# EAGLE design TIPIC_Schematic1 (EAGLE 6.2)
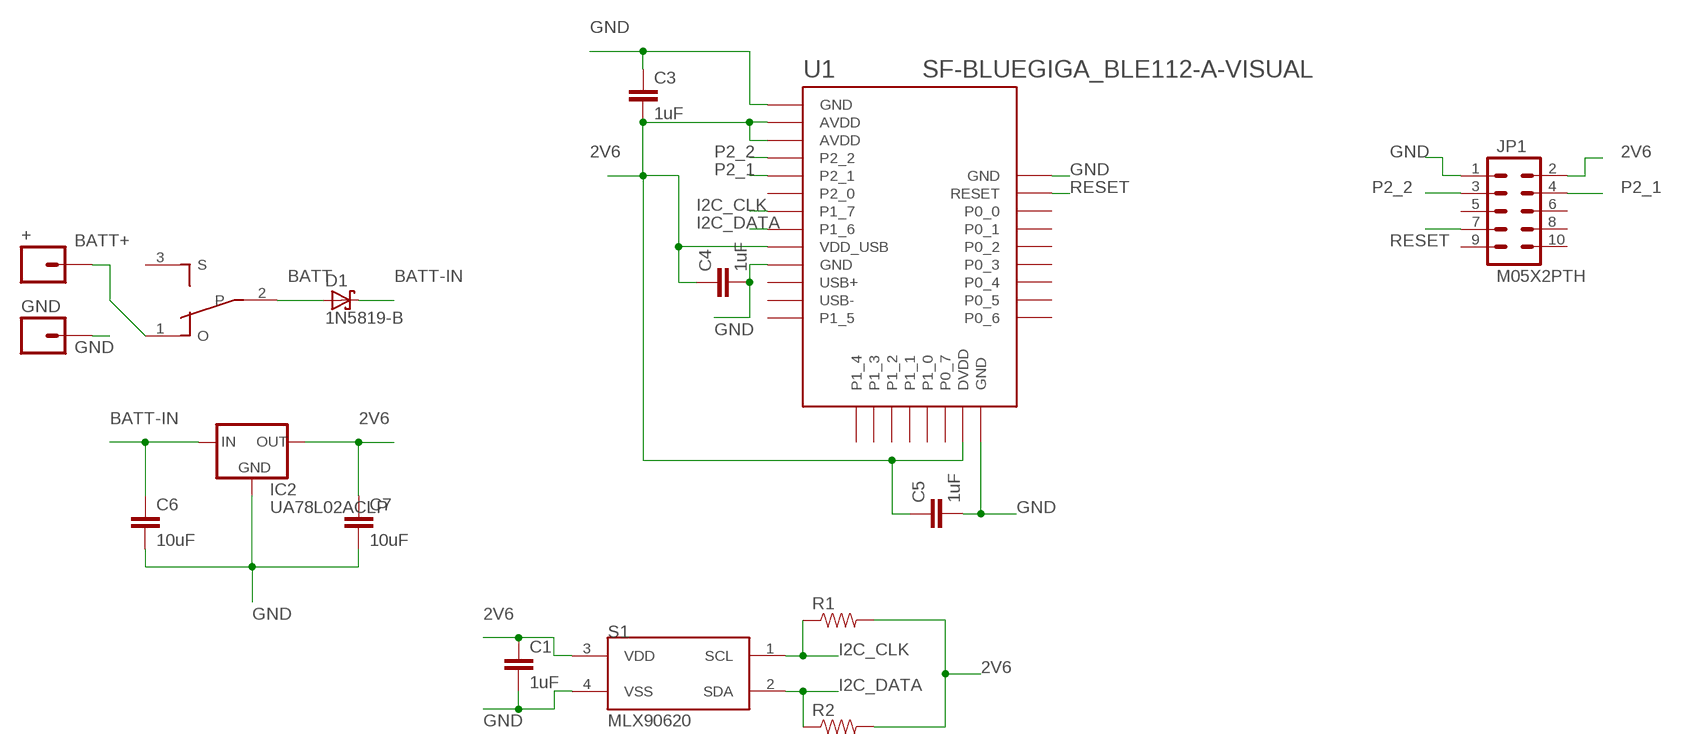
[diagram p0: schematic, sheet 1]

## Parts
+  M01PTH  [1X01]
C1  1uF  CAPPTH1  [CAP-PTH-5MM]
C3  1uF  CAPPTH1  [CAP-PTH-5MM]
C4  1uF  CAPPTH1  [CAP-PTH-5MM]
C5  1uF  CAPPTH1  [CAP-PTH-5MM]
C6  10uF  CAPPTH1  [CAP-PTH-5MM]
C7  10uF  CAPPTH1  [CAP-PTH-5MM]
D1  1N5819-B  [DO41-7.6]
GND  M01PTH  [1X01]
IC2  UA78L02ACLP  2V6-VREG  [TO-92]
JP1  M05X2PTH  [AVR_ICSP]
R1  RESISTORPTH-1/4W  [AXIAL-0.4]
R2  RESISTORPTH-1/4W  [AXIAL-0.4]
S1  MLX90620  [TO-39]
S2  SMALL_SWITCH  [EG1213]
U1  SF-BLUEGIGA_BLE112-A-VISUAL  [SF-BLUEGIGA_BLE112-A]

## Nets
2V6: C1.1 C3.2 C4.1 C5.1 C7.1 IC2.1(OUT) JP1.2 R1.P$2 R2.P$2 S1.3(VDD) U1.AVDD1(AVDD) U1.AVDD2(AVDD) U1.DVDD U1.VDD_USB
BATT: D1.A S2.2(P)
BATT+: +.1 S2.1(O)
BATT-IN: C6.1 D1.C IC2.3(IN)
GND: C1.2 C3.1 C4.2 C5.2 C6.2 C7.2 GND.1 IC2.2(GND) JP1.1 S1.4(VSS) U1.GND1(GND) U1.GND2(GND) U1.GND3(GND) U1.GND4(GND)
I2C_CLK: R1.P$1 S1.1(SCL) U1.P1_7
I2C_DATA: R2.P$1 S1.2(SDA) U1.P1_6
P2_1: JP1.4 U1.P2_1
P2_2: JP1.3 U1.P2_2
RESET: JP1.7 U1.RESET
Unconnected: JP1.5 JP1.6 JP1.8 JP1.9 JP1.10 S2.3(S) U1.P0_0 U1.P0_1 U1.P0_2 U1.P0_3 U1.P0_4 U1.P0_5 U1.P0_6 U1.P0_7 U1.P1_0 U1.P1_1 U1.P1_2 U1.P1_3 U1.P1_4 U1.P1_5 U1.P2_0 U1.USB+ U1.USB-

## Library data of the parts
+ GND = SparkFun-Connectors:M01: Header 1 Standard 1-pin 0.1" header. Use with straight break away headers (SKU : PRT-00116), right angle break away headers (PRT-00553), swiss pins (PRT-00743), machine pins (PRT-00117), and female headers (PRT-00115).
C1 C3-C7 = SparkFun-Boards:CAP: Capacitor Standard 0603 ceramic capacitor, and 0.1" leaded capacitor.
D1 = diode:1N581*: 1.0A SCHOTTKY BARRIER RECTIFIER Source: http://www.diodes.com/datasheets/ds23001.pdf
IC2 = RHWorkshop:2V6-VREG
JP1 = SparkFun-Connectors:M05X2: Header 5x2 Standard 10-pin dual row 0.1" header. Commonly used with AVR-ISP. Use with Spark Fun Electronics SKU: PRT-00778
R1 R2 = SparkFun-LED:RESISTOR: Resistor Basic schematic elements and footprints for 0603, 1206, and PTH resistors.
S1 = RHWorkshop:MLX90620: The MLX90620 is a fully calibrated 16x4 pixels IR array in an industry standard 4-lead TO-39 package. It contains 2 chips in one package: the Mlx90670 (IR array with signal conditioning electronics) and the 24AA02 (256x8 EEPROM) chip. The MlX90620 contains 64 IR pixels with dedicated low noise chopper stabilized amplifier and fast ADC integrated. A PTAT (Proportional To Absolute Temperature) sensor is integrated to measure the ambient temperature of the chip. The outputs of both IR and PTAT sensors are stored in internal RAM and are accessible through I2C.
S2 = RHWorkshop:SMALL_SWITCH
U1 = RHWorkshop:SF-BLUEGIGA_BLE112-A-VISUAL: Bluetooth Low Energy single-mode module - Bluetooth 4.0, chip antenna

## Net classes
0 default: width 0.406 mm, drill 0.305 mm, clearance 0.305 mm

## Board
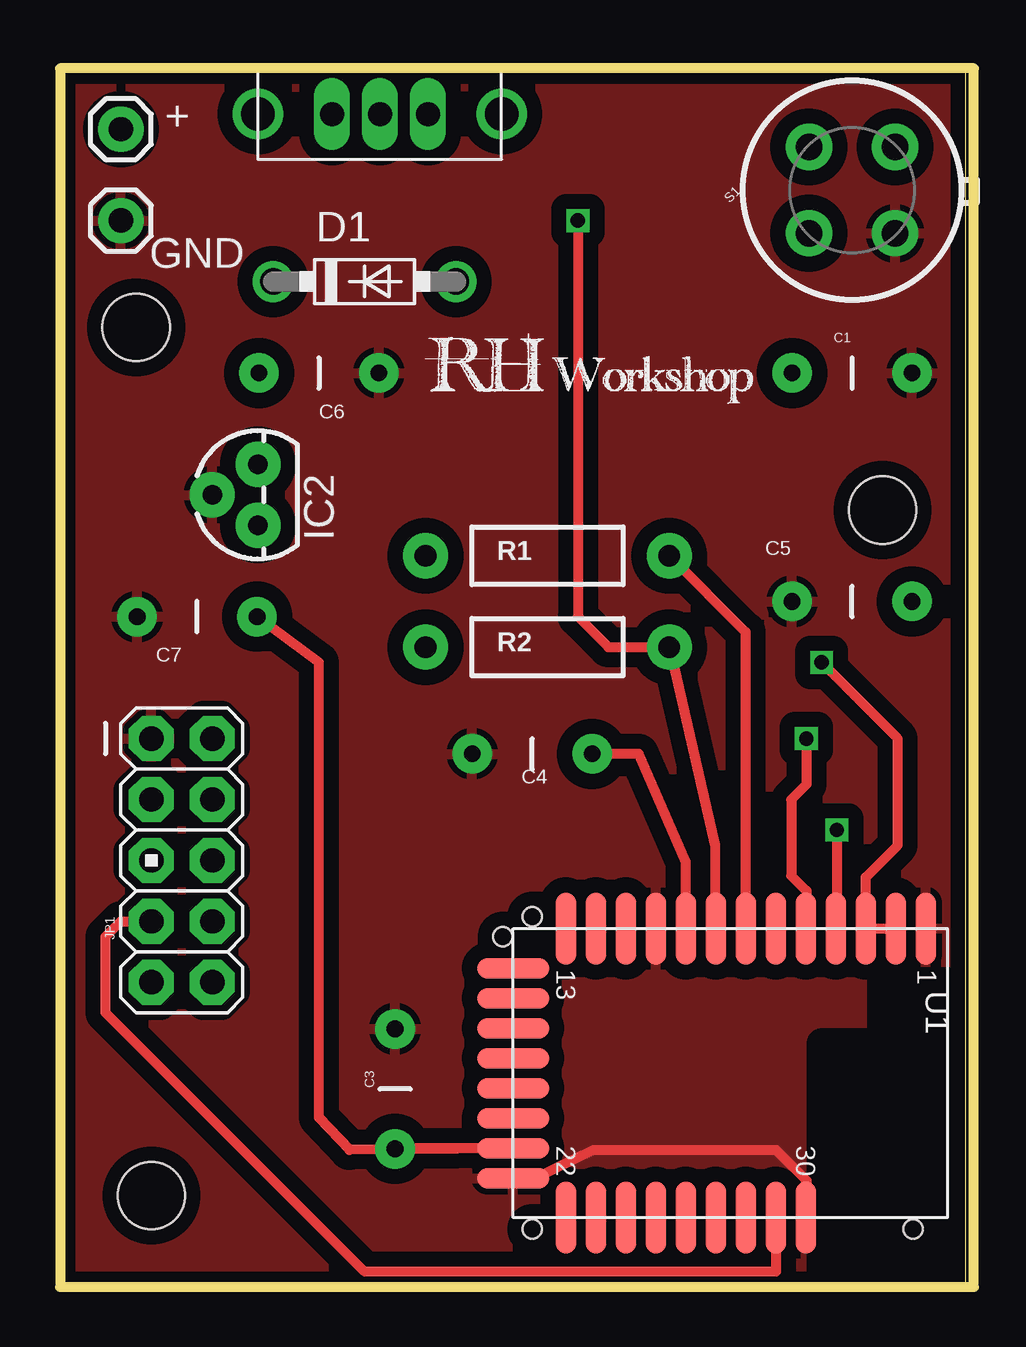
[diagram p1: board, top side]
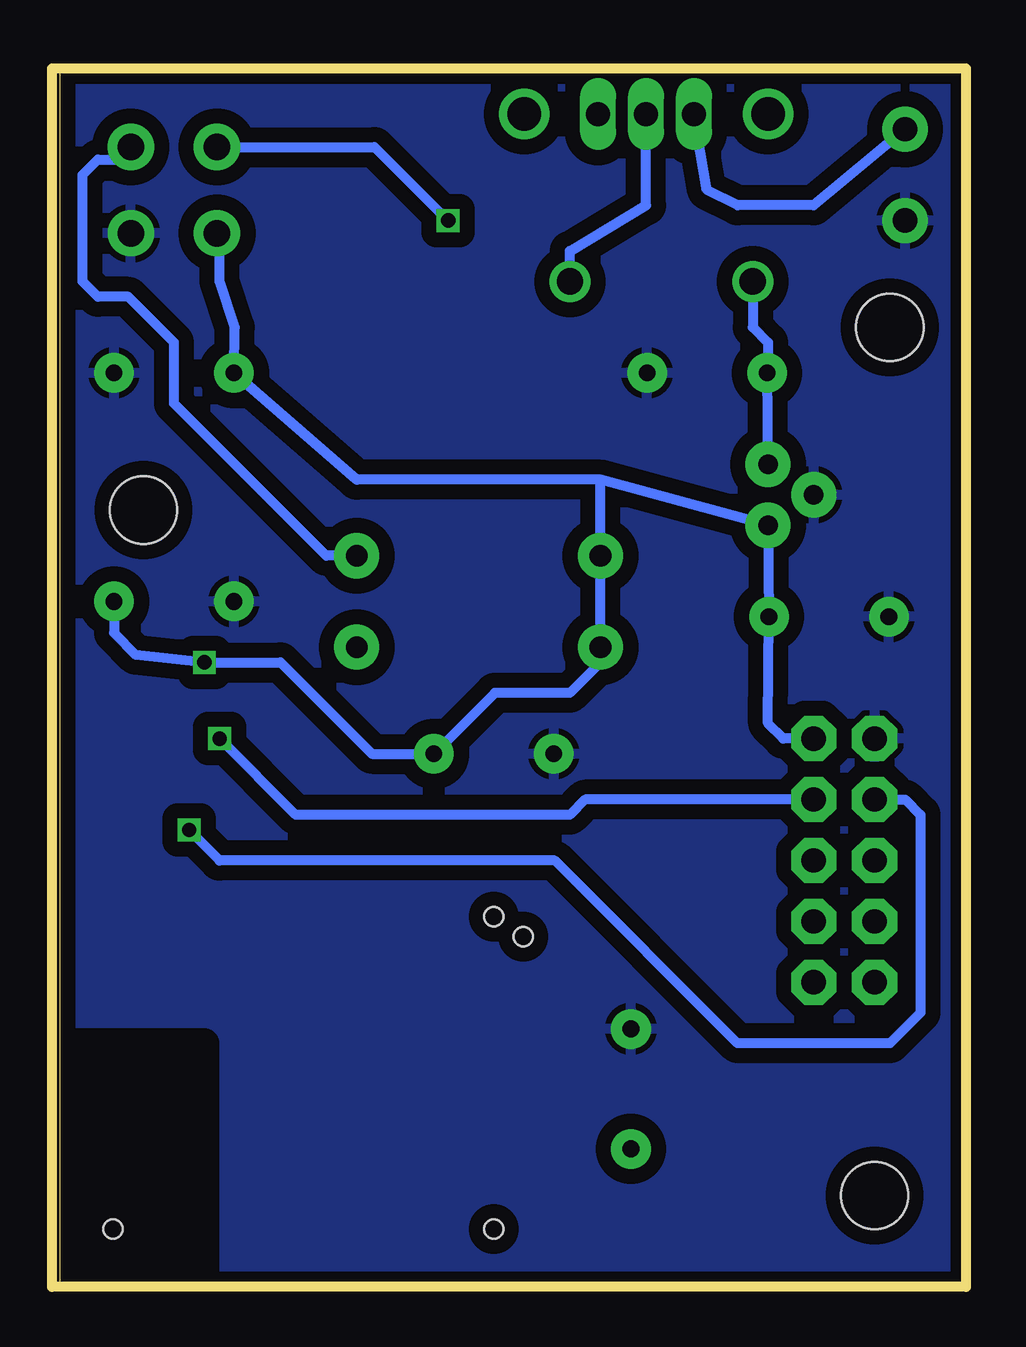
[diagram p2: board, bottom side, seen from below]

Size 37.77 x 50.79 mm. Coordinates in mm from the lower left corner, seen from the top.
Outline: 0,0 37.77,0 37.77,50.79 0,50.79 0,0
Copper layers (1*16): Top 0.0356mm / dielectric 1.5011mm / Bottom 0.0356mm
Design rules: minimum track width 6mil, minimum drill 13mil, track to track 6mil, track to pad 6mil, pad to pad 6mil, via to via 6mil, smd to smd 6mil, copper to edge 15mil, drill to drill 6mil, minimum pad ring 7mil, minimum via ring 7mil, stop-mask expansion 4mil, vias tented up to drill 0mil, thermal gap 10mil
Holes 2.8 mm at 3.81,3.81 34.29,32.38 3.17,40.01
Holes 0.8 mm at 35.56,2.41 19.68,2.41 19.68,15.44
Holes 0.79 mm at 18.47,14.61
tRestrict: area 31.7,0 to 38.1,10.2; area 34.3,10.2 to 38.1,12.7
bRestrict: area 31.7,0 to 38.1,10.2
Milling: 4 lines

### Footprints (pad centres in the part's own frame; a part is rotated, then mirrored left to right if it is on the bottom)
1X01 = drill 1.016 pad 1.88: 1 0,0
CAP-PTH-5MM = drill 0.7 pad 1.651: 1 -2.5,0; 2 2.5,0
DO41-7.6 = drill 1.1 pad 1.7: A 3.81,0; C -3.81,0
TO-92 = drill 0.813 pad 1.88: 1 -1.27,0; 2 0,1.905; 3 1.27,0
AVR_ICSP = drill 1.016 pad 1.88 octagon: 1 -1.27,5.08; 2 1.27,5.08; 3 -1.27,2.54; 4 1.27,2.54; 5 -1.27,0; 6 1.27,0; 7 -1.27,-2.54; 8 1.27,-2.54; 9 -1.27,-5.08; 10 1.27,-5.08
AXIAL-0.4 = drill 0.9 pad 1.88: P$1 -5.08,0; P$2 5.08,0
TO-39 = drill 1.1 pad 1.93: 1 2.54,0; 2 0,2.54; 3 -2.54,0; 4 0,-2.54
EG1213 = drill 1 long: 1 -1.999,0; 2 0,0; 3 1.999,0 | drill 1.4: P$1 -5.08,0; P$2 5.08,0
SF-BLUEGIGA_BLE112-A = smd 3 x 0.85: AVDD1 -6.05,6.9; AVDD2 -6.05,5.65; GND1 -6.05,8.15; GND2 -6.05,-3.1; GND4 6,3.15; P0_0 6,0.65; P0_1 6,-0.6; P0_2 6,-1.85; P0_3 6,-3.1; P0_4 6,-4.35; P0_5 6,-5.6; P0_6 6,-6.85; P1_5 -6.05,-6.85; P1_6 -6.05,-0.6; P1_7 -6.05,0.65; P2_0 -6.05,1.9; P2_1 -6.05,3.15; P2_2 -6.05,4.4; RESET 6,1.9; USB+ -6.05,-4.35; USB- -6.05,-5.6; VDD_USB -6.05,-1.85 | smd 0.85 x 3: DVDD 3.1,-9.05; GND3 4.35,-9.05; P0_7 1.85,-9.05; P1_0 0.6,-9.05; P1_1 -0.65,-9.05; P1_2 -1.9,-9.05; P1_3 -3.15,-9.05; P1_4 -4.4,-9.05

### Placement (x,y rotation side)
+  2.54,48.26 0 top
C1  33.02,38.1 0 top
C3  13.97,8.26 270 top
C4  19.68,22.23 180 top
C5  33.02,28.57 180 top
C6  10.79,38.1 0 top
C7  5.71,27.94 180 top
D1  12.7,41.91 0 top
GND  2.54,44.45 0 top
IC2  8.26,33.02 90 top
JP1  5.08,17.78 0 top
R1  20.32,30.48 180 top
R2  20.32,26.67 180 top
S1  33.02,45.72 45 top
S2  13.34,48.9 0 top
U1  27.94,8.89 270 top
U$1  [RH-LOGO]  15.24,36.83 0 top

### Tracks (layer width: path | path; a pad name or v marks a point on that pad's centre or on a via)
2V6  (via drill 0.6)
  Top 0.406: U1.AVDD1 U1.AVDD2 33.59,17.08 34.92,18.41 34.92,22.86 v31.75,26.04 | U1.VDD_USB 26.09,17.73 24.13,22.23 C4.1 | C3.2 14.04,5.79 U1.DVDD 12.06,5.71 10.79,7.06 10.79,26.04 C7.1
  Bottom 0.406: 15.24,33.66 IC2.1 C7.1 8.26,23.5 7.62,22.86 JP1.2 | 15.24,33.66 R1.P$2 R2.P$2 15.24,26.04 16.51,24.77 19.64,24.77 C4.1 24.77,22.23 28.57,26.04 v31.75,26.04 34.61,26.35 35.52,27.27 C5.1 | 15.24,33.66 25.4,33.66 C1.1 30.48,40.01 31.11,41.91 31.11,43.81 S1.3
BATT
  Bottom 0.406: D1.A 16.51,43.18 13.34,45.09 S2.2
BATT+
  Bottom 0.406: +.1 6.35,45.09 9.53,45.09 10.79,45.72 S2.1
BATT-IN
  Bottom 0.406: IC2.3 C6.1 8.26,38.14 8.26,39.37 8.89,40.01 D1.C
GND
  Top 0.406: U1.GND3 19.78,4.54 22.23,5.71 29.84,5.71 31.11,4.45 31.11,2.92 U1.GND4
  pour Top (isolate 0.635, rank 6): 0,50.8 38.1,50.8 38.1,0 0,0
  pour Bottom (isolate 0.635, rank 6): 0,50.8 38.1,50.8 38.1,0 0,0
I2C_CLK
  Top 0.406: R1.P$1 28.57,27.3 28.57,14.96 U1.P1_7
  Bottom 0.406: R1.P$1 26.67,30.48 33.02,36.83 33.02,39.37 34.92,41.27 36.2,41.27 36.83,41.91 36.83,46.35 36.2,46.99 35.34,46.99 S1.1
I2C_DATA  (via drill 0.6)
  Top 0.406: U1.P1_6 27.3,14.97 27.3,18.41 R2.P$1 22.86,26.67 21.59,27.94 v21.59,44.45
  Bottom 0.406: S1.2 24.66,47.52 v21.59,44.45
P2_1  (via drill 0.6)
  Top 0.406: v31.11,22.86 31.11,20.95 30.48,20.32 30.48,17.14 31.11,16.51 31.11,14.96 U1.P2_1
  Bottom 0.406: JP1.4 15.88,20.32 16.51,19.68 27.94,19.68 v31.11,22.86
P2_2  (via drill 0.6)
  Top 0.406: v32.38,19.05 32.38,14.98 U1.P2_2
  Bottom 0.406: JP1.3 2.54,20.32 1.91,19.68 1.91,11.43 3.17,10.16 9.53,10.16 17.14,17.78 31.11,17.78 v32.38,19.05
RESET
  Top 0.406: U1.RESET 29.84,0.64 12.7,0.64 1.91,11.43 1.91,14.61 2.54,15.24 JP1.7